# Altium schematic sheet Sheet3.SchDoc
size A
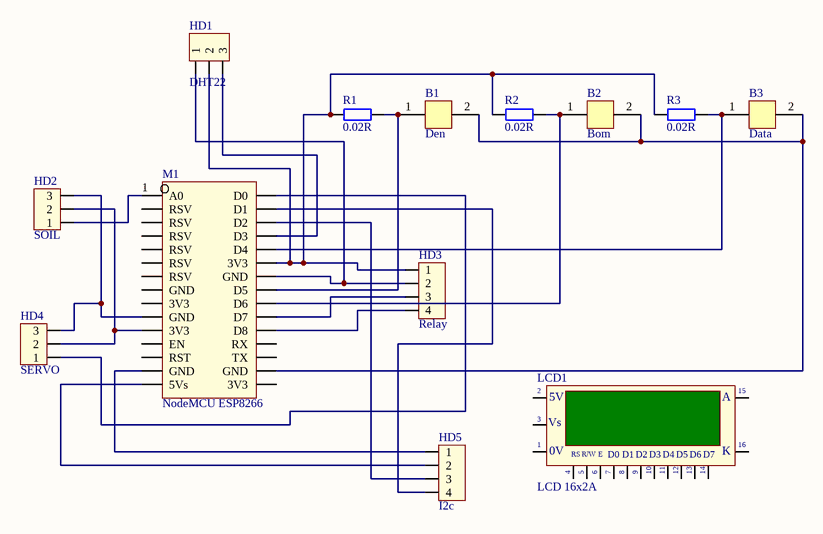
[diagram p0: Sheet3.SchDoc]

## Parts
B1  Den  [Button 2 Pin]
B2  Bom  [Button 2 Pin]
B3  Data  [Button 2 Pin]
HD1  DHT22  [HED3]
HD2  SOIL  [HED3]
HD3  Relay  [HED4]
HD4  SERVO  [HED3]
HD5  I2c  [HED4]
LCD1  LCD 16x2A  [LCD16X2]
M1  NodeMCU ESP8266  [NodeMCU ESP8266]
R1  0.02R  [tro vach 3w]
R2  0.02R  [tro vach 3w]
R3  0.02R  [tro vach 3w]

## Nets
NetB1_1: B1.1 M1.23(D5) R1.2
NetB1_2: B1.2 B2.2 B3.2 M1.17(GND)
NetB2_1: B2.1 M1.22(D6) R2.2
NetB3_1: B3.1 M1.26(D4) R3.2
NetHD1_1: HD1.1 HD3.2 M1.24(GND)
NetHD1_2: HD1.2 HD3.1 M1.25(3V3) R1.1 R2.1 R3.1
NetHD1_3: HD1.3 M1.27(D3)
NetHD2_1: HD2.1 M1.1(A0)
NetHD2_2: HD2.2 HD4.2 M1.11(3V3)
NetHD2_3: HD2.3 HD4.3 M1.10(GND)
NetHD3_3: HD3.3 M1.21(D7)
NetHD3_4: HD3.4 M1.20(D8)
NetHD4_1: HD4.1 M1.30(D0)
NetHD5_1: HD5.1 M1.14(GND)
NetHD5_2: HD5.2 M1.15(5Vs)
NetHD5_3: HD5.3 M1.28(D2)
NetHD5_4: HD5.4 M1.29(D1)

Not connected (* = marked no-connect by the designer): LCD1 1(GND) 2(VDD) 3(VEE) 4(RS) 5(R/~{W}) 6(~{EN}) 7(D0) 8(D1) 9(D2) 10(D3) 11(D4) 12(D5) 13(D6) 14(D7) 15(A) 16(K); M1 2(RSV) 3(RSV) 4(RSV) 5(RSV) 6(RSV) 7(RSV) 8(GND) 9(3V3) 12(EN) 13(RST) 16(3V3) 18(TX) 19(RX)

## Notes on the sheet
- (in symbol LCD16x2A) 5V; Vs; |; 0V; R/W; E

## Library data of the parts
B1-B3 = Nut Nhan 2 Chan  6x6x5MM: Cắm; Ten_Linh_Kien: Nút Nhấn 2 Chân 6x6x5MM DIP; Don_Vi: Con; Ma_Hang: MH001959; Ghi_Chu: *; Kieu_Chan: *; Chung_Loai: Cắm
HD1 HD2 HD4 = Hed3: Header 3 (Green); Value: Header 3
HD3 HD5 = Hed4: Header 4 (Green); Value: Header 4
LCD1 = LCD16x2A: LCD dipslay 16 char, 2 line; Value: LCD16x2A
R1-R3 = Tro Vach 3W 5% 0.02R: Cắm; Don_Vi: Con; So_Chan: 2; Ten_Linh_Kien: Trở 5% 3w 0.02R; Ma_Hang: MH007953; Chung_Loai: Cắm; Kieu_Chan: *